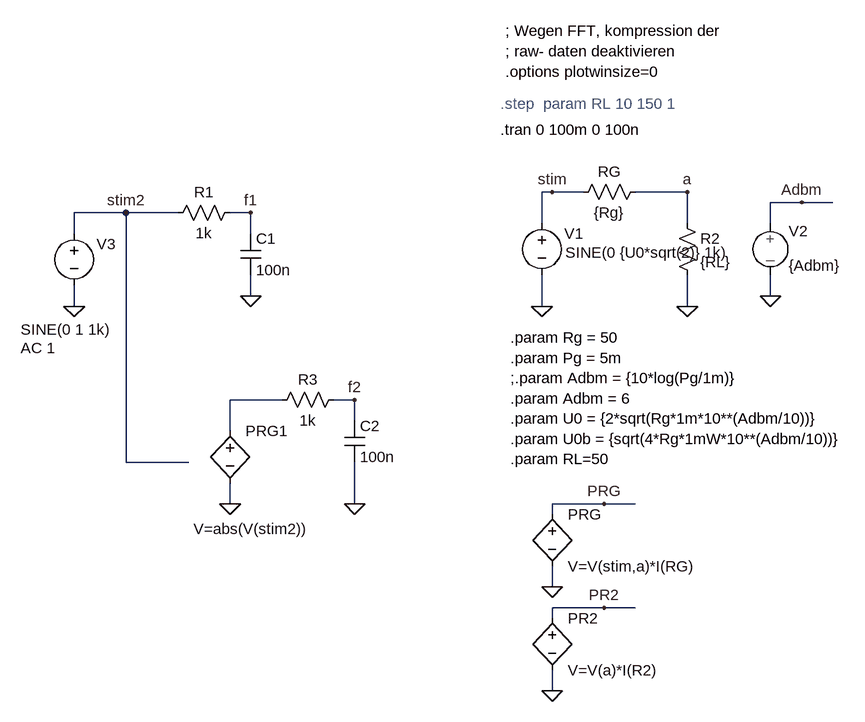
[diagram p0: schematic urspannung.asc]
urspannung.asc, the LTspice schematic file:
Version 4
SHEET 1 880 708
WIRE 0 -80 -16 -80
WIRE 48 -80 0 -80
WIRE 208 -80 128 -80
WIRE 384 -64 336 -64
WIRE 432 -64 384 -64
WIRE -656 -48 -736 -48
WIRE -576 -48 -656 -48
WIRE -464 -48 -496 -48
WIRE -16 -32 -16 -80
WIRE 208 -32 208 -80
WIRE 336 -32 336 -64
WIRE -736 -16 -736 -48
WIRE -464 -16 -464 -48
WIRE -464 80 -464 48
WIRE 336 80 336 48
WIRE -736 96 -736 64
WIRE -16 96 -16 48
WIRE 208 96 208 48
WIRE -416 240 -496 240
WIRE -304 240 -336 240
WIRE -304 272 -304 240
WIRE -496 288 -496 240
WIRE -656 336 -656 -48
WIRE -560 336 -656 336
WIRE -496 400 -496 368
WIRE -304 400 -304 336
WIRE 80 400 0 400
WIRE 128 400 80 400
WIRE 0 416 0 400
WIRE 0 528 0 496
WIRE 80 560 0 560
WIRE 128 560 80 560
WIRE 0 576 0 560
WIRE 0 688 0 656
FLAG -16 96 0
FLAG 208 96 0
FLAG 0 -80 stim
FLAG 336 80 0
FLAG 384 -64 Adbm
FLAG 208 -80 a
FLAG 0 528 0
FLAG 0 688 0
FLAG 80 400 PRG
FLAG 80 560 PR2
FLAG -464 80 0
FLAG -464 -48 f1
FLAG -736 96 0
FLAG -304 240 f2
FLAG -496 400 0
FLAG -656 -48 stim2
FLAG -304 400 0
SYMBOL voltage -16 -48 M0
WINDOW 3 -36 61 Right 2
WINDOW 123 -42 314 Left 2
WINDOW 39 0 0 Left 2
WINDOW 0 -35 32 Right 2
SYMATTR Value SINE(0 {U0*sqrt(2)} 1k)
SYMATTR InstName V1
SYMBOL res 32 -64 R270
WINDOW 0 32 56 VTop 2
WINDOW 3 0 56 VBottom 2
SYMATTR InstName RG
SYMATTR Value {Rg}
SYMBOL res 192 -48 R0
SYMATTR InstName R2
SYMATTR Value {RL}
SYMBOL source-V 336 -48 R0
WINDOW 123 0 0 Left 2
WINDOW 39 0 0 Left 2
SYMATTR InstName V2
SYMATTR Value {Adbm}
SYMBOL bv 0 400 R0
SYMATTR InstName PRG
SYMATTR Value V=V(stim,a)*I(RG)
SYMBOL bv 0 560 R0
SYMATTR InstName PR2
SYMATTR Value V=V(a)*I(R2)
SYMBOL res -480 -64 R90
WINDOW 0 0 56 VBottom 2
WINDOW 3 32 56 VTop 2
SYMATTR InstName R1
SYMATTR Value 1k
SYMBOL cap -480 -16 R0
SYMATTR InstName C1
SYMATTR Value 100n
SYMBOL voltage -736 -32 M0
WINDOW 3 82 164 Right 2
WINDOW 123 82 192 Right 2
WINDOW 39 0 0 Left 2
WINDOW 0 -35 32 Right 2
SYMATTR Value SINE(0 1 1k)
SYMATTR Value2 AC 1
SYMATTR InstName V3
SYMBOL res -320 224 R90
WINDOW 0 0 56 VBottom 2
WINDOW 3 32 56 VTop 2
SYMATTR InstName R3
SYMATTR Value 1k
SYMBOL cap -320 272 R0
SYMATTR InstName C2
SYMATTR Value 100n
SYMBOL bv -496 272 R0
WINDOW 3 -56 167 Left 2
SYMATTR InstName PRG1
SYMATTR Value V=abs(V(stim2))
TEXT -80 -216 Left 2 ;.step  param RL 10 150 1
TEXT -80 -176 Left 2 !.tran 0 100m 0 100n
TEXT -64 144 Left 2 !.param Rg = 50\n.param Pg = 5m\n;.param Adbm = {10*log(Pg/1m)}\n.param Adbm = 6\n.param U0 = {2*sqrt(Rg*1m*10**(Adbm/10))}\n.param U0b = {sqrt(4*Rg*1mW*10**(Adbm/10))}\n.param RL=50
TEXT -72 -328 Left 2 !; Wegen FFT, kompression der \n; raw- daten deaktivieren\n.options plotwinsize=0

The netlist it stands for:
* urspannung.asc
V1 stim 0 SINE(0 {U0*sqrt(2)} 1k)
RG stim a {Rg}
R2 a 0 {RL}
V2 Adbm 0 {Adbm}
B§PRG PRG 0 V=V(stim,a)*I(RG)
B§PR2 PR2 0 V=V(a)*I(R2)
R1 f1 stim2 1k
C1 f1 0 100n
V3 stim2 0 SINE(0 1 1k) AC 1
R3 f2 N001 1k
C2 f2 0 100n
B§PRG1 N001 0 V=abs(V(stim2))
* .step  param RL 10 150 1
.tran 0 100m 0 100n
.param Rg = 50
.param Pg = 5m
;.param Adbm = {10*log(Pg/1m)}
.param Adbm = 6
.param U0 = {2*sqrt(Rg*1m*10**(Adbm/10))}
.param U0b = {sqrt(4*Rg*1mW*10**(Adbm/10))}
.param RL=50
; Wegen FFT, kompression der
; raw- daten deaktivieren
.options plotwinsize=0
.backanno
.end